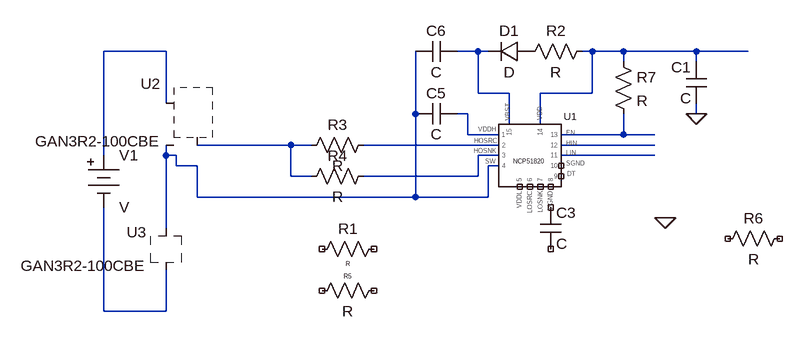
[diagram p0: schematic Draft2.asc]
Draft2.asc, the LTspice schematic file:
Version 4
SHEET 1 880 680
WIRE -384 32 -480 32
WIRE 96 32 64 32
WIRE 112 32 96 32
WIRE 272 32 256 32
WIRE 320 32 272 32
WIRE 432 32 320 32
WIRE 512 32 432 32
WIRE 320 48 320 32
WIRE 432 48 432 32
WIRE 96 96 96 32
WIRE 144 96 96 96
WIRE 272 96 272 32
WIRE 272 96 192 96
WIRE -384 112 -384 32
WIRE 0 128 0 32
WIRE 80 128 64 128
WIRE 432 128 432 112
WIRE 144 144 144 96
WIRE 192 144 192 96
WIRE 80 160 80 128
WIRE 128 160 80 160
WIRE 320 160 320 128
WIRE 320 160 224 160
WIRE 368 160 320 160
WIRE -192 176 -336 176
WIRE -160 176 -192 176
WIRE 128 176 -80 176
WIRE 368 176 224 176
WIRE -480 192 -480 32
WIRE -384 192 -384 176
WIRE -368 192 -384 192
WIRE 128 192 96 192
WIRE 368 192 224 192
WIRE -368 208 -368 192
WIRE -336 208 -368 208
WIRE 128 208 112 208
WIRE -192 224 -192 176
WIRE -160 224 -192 224
WIRE 96 224 96 192
WIRE 96 224 -80 224
WIRE -336 256 -336 208
WIRE 0 256 0 128
WIRE 0 256 -336 256
WIRE 112 256 112 208
WIRE 112 256 0 256
WIRE -384 304 -384 192
WIRE -480 432 -480 272
WIRE -384 432 -384 368
WIRE -384 432 -480 432
FLAG 432 128 0
FLAG 384 288 0
SYMBOL AutoGenerated\\NCP51820_Gate\ driver 176 192 R0
SYMATTR InstName U1
SYMBOL res -48 320 R90
WINDOW 0 0 56 VBottom 2
WINDOW 3 32 56 VTop 0
SYMATTR InstName R1
SYMBOL res 272 16 R90
WINDOW 0 0 56 VBottom 2
WINDOW 3 32 56 VTop 2
SYMATTR InstName R2
SYMBOL res -64 160 R90
WINDOW 0 0 56 VBottom 2
WINDOW 3 32 56 VTop 2
SYMATTR InstName R3
SYMBOL res -64 208 R90
WINDOW 0 0 56 VBottom 2
WINDOW 3 32 56 VTop 2
SYMATTR InstName R4
SYMBOL res -48 384 R90
WINDOW 0 0 56 VBottom 0
WINDOW 3 32 56 VTop 2
SYMATTR InstName R5
SYMBOL cap 448 112 R180
WINDOW 0 24 56 Left 2
WINDOW 3 24 8 Left 2
SYMATTR InstName C1
SYMBOL cap 192 272 R0
SYMATTR InstName C3
SYMBOL cap 64 112 R90
WINDOW 0 0 32 VBottom 2
WINDOW 3 32 32 VTop 2
SYMATTR InstName C5
SYMBOL cap 64 16 R90
WINDOW 0 0 32 VBottom 2
WINDOW 3 32 32 VTop 2
SYMATTR InstName C6
SYMBOL Misc\\battery -480 176 R0
SYMATTR InstName V1
SYMBOL diode 176 16 R90
WINDOW 0 0 32 VBottom 2
WINDOW 3 32 32 VTop 2
SYMATTR InstName D1
SYMBOL res 576 304 R90
WINDOW 0 0 56 VBottom 2
WINDOW 3 32 56 VTop 2
SYMATTR InstName R6
SYMBOL AutoGenerated\\GAN3R2-100CBE -368 144 M0
SYMATTR InstName U2
SYMBOL AutoGenerated\\GAN3R2-100CBE -368 336 M0
SYMATTR InstName U3
SYMBOL res 304 32 R0
SYMATTR InstName R7

The netlist it stands for:
* Draft2.asc
XU1 N003 N002 N005 N010 N008 N004 N009 N006 N011 NC_01 NC_02 NC_03 NC_04 NC_05 NC_06 NCP51820  ; pins 32 33 34 36 35 37 38 39 40 41 42 43 44 46 45
R1 NC_07 NC_08 R
R2 N003 P001 R
R3 N008 N007 R
R4 N010 N007 R
R5 NC_09 NC_10 R
C1 0 N003 C
C3 NC_11 NC_12 C
C5 N005 N004 C
C6 N002 N004 C
V1 N001 N012 V
D1 P001 N002 D
R6 NC_13 NC_14 R
* U2: GAN3R2-100CBE (symbol AutoGenerated\GAN3R2-100CBE not available, pin order unknown); nets seen at it: N001, N004, N007
* U3: GAN3R2-100CBE (symbol AutoGenerated\GAN3R2-100CBE not available, pin order unknown); nets seen at it: N004, N012
R7 N003 N006 R
.model D D
.lib standard.dio
.lib C:\Users\IPTIF\Desktop\Synchronous_Buck converter\NCP51820 SIM MODEL\NCP51820_Simplis_Model\NCP51820_rev1.lb
.backanno
.end